# Altium schematic sheet LTC2666-16.SchDoc
size A; SheetNumber: 20; SheetTotal: 24
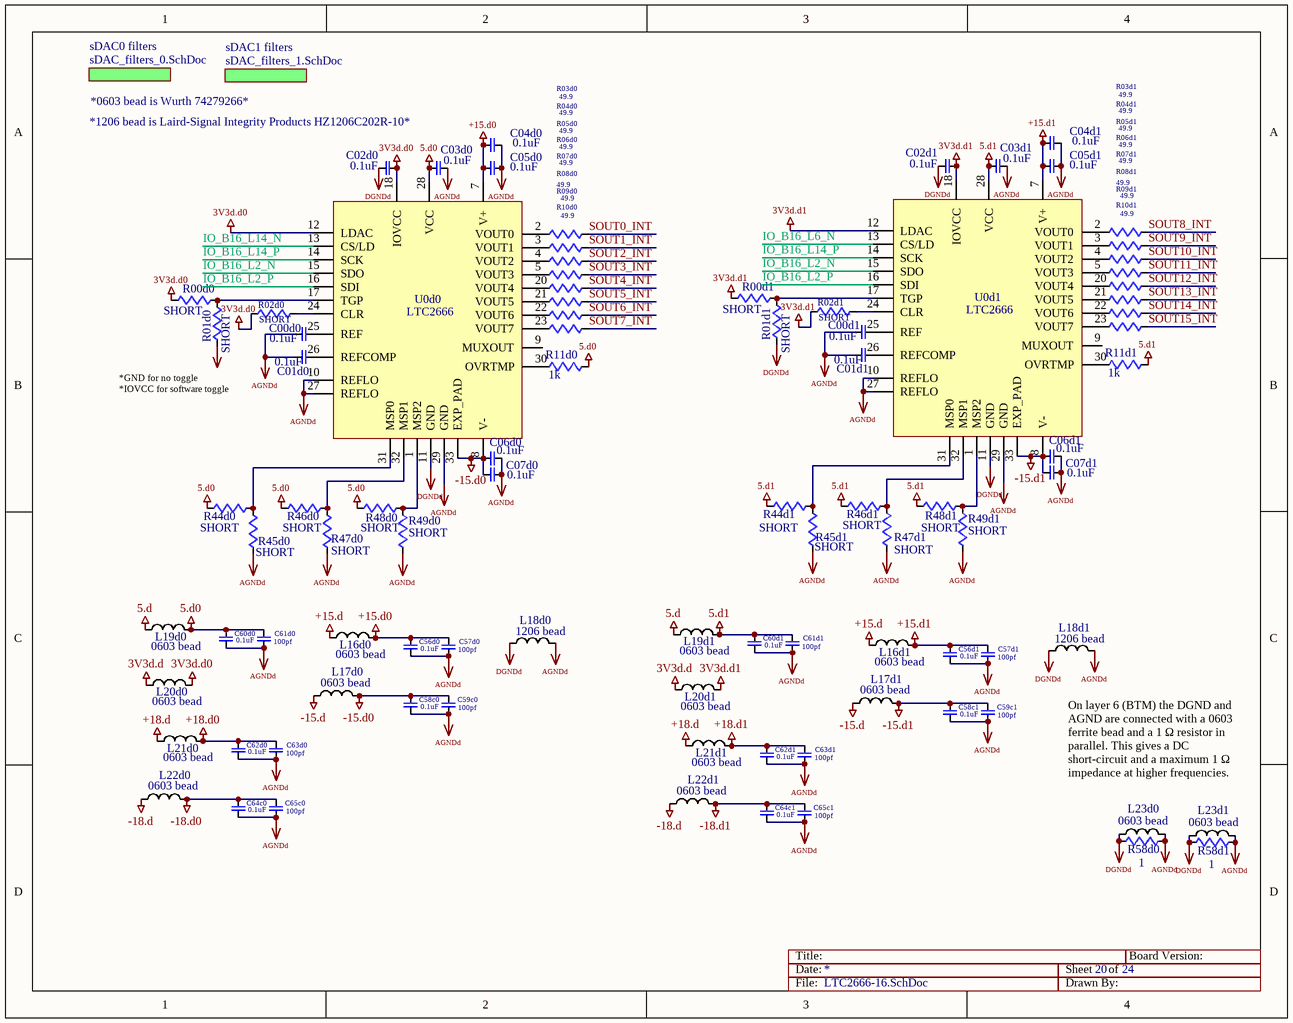
[diagram p0: LTC2666-16.SchDoc]

## Parts
C00d0  0.1uF  [0603]
C00d1  0.1uF  [0603]
C01d0  0.1uF  [0603]
C01d1  0.1uF  [0603]
C02d0  0.1uF  [0603]
C02d1  0.1uF  [0603]
C03d0  0.1uF  [0603]
C03d1  0.1uF  [0603]
C04d0  0.1uF  [0603]
C04d1  0.1uF  [0603]
C05d0  0.1uF  [0603]
C05d1  0.1uF  [0603]
C06d0  0.1uF  [0603]
C06d1  0.1uF  [0603]
C07d0  0.1uF  [0603]
C07d1  0.1uF  [0603]
C56d0  0.1uF  [0603]
C56d1  0.1uF  [0603]
C57d0  100pf  [0603]
C57d1  100pf  [0603]
C58c0  0.1uF  [0603]
C58c1  0.1uF  [0603]
C59c0  100pf  [0603]
C59c1  100pf  [0603]
C60d0  0.1uF  [0603]
C60d1  0.1uF  [0603]
C61d0  100pf  [0603]
C61d1  100pf  [0603]
C62d0  0.1uF  [0603]
C62d1  0.1uF  [0603]
C63d0  100pf  [0603]
C63d1  100pf  [0603]
C64c0  0.1uF  [0603]
C64c1  0.1uF  [0603]
C65c0  100pf  [0603]
C65c1  100pf  [0603]
L16d0  0603 bead  [0603]
L16d1  0603 bead  [0603]
L17d0  0603 bead  [0603]
L17d1  0603 bead  [0603]
L18d0  1206 bead  [1206]
L18d1  1206 bead  [1206]
L19d0  0603 bead  [0603]
L19d1  0603 bead  [0603]
L20d0  0603 bead  [0603]
L20d1  0603 bead  [0603]
L21d0  0603 bead  [0603]
L21d1  0603 bead  [0603]
L22d0  0603 bead  [0603]
L22d1  0603 bead  [0603]
L23d0  0603 bead  [0603]
L23d1  0603 bead  [0603]
R00d0  SHORT  [0603]
R00d1  SHORT  [0603]
R01d0  SHORT  [0603]
R01d1  SHORT  [0603]
R02d0  SHORT  [0603]
R02d1  SHORT  [0603]
R03d0  49.9  [0603]
R03d1  49.9  [0603]
R04d0  49.9  [0603]
R04d1  49.9  [0603]
R05d0  49.9  [0603]
R05d1  49.9  [0603]
R06d0  49.9  [0603]
R06d1  49.9  [0603]
R07d0  49.9  [0603]
R07d1  49.9  [0603]
R08d0  49.9  [0603]
R08d1  49.9  [0603]
R09d0  49.9  [0603]
R09d1  49.9  [0603]
R10d0  49.9  [0603]
R10d1  49.9  [0603]
R11d0  1k  [0603]
R11d1  1k  [0603]
R44d0  SHORT  [0603]
R44d1  SHORT  [0603]
R45d0  SHORT  [0603]
R45d1  SHORT  [0603]
R46d0  SHORT  [0603]
R46d1  SHORT  [0603]
R47d0  SHORT  [0603]
R47d1  SHORT  [0603]
R48d0  SHORT  [0603]
R48d1  SHORT  [0603]
R49d0  SHORT  [0603]
R49d1  SHORT  [0603]
R58d0  1  [0603]
R58d1  1  [0603]
U0d0  LTC2666  [32QFN]
U0d1  LTC2666  [32QFN]

## Sub-sheets
sDAC0 filters = sDAC_filters_0.SchDoc: no entries
sDAC1 filters = sDAC_filters_1.SchDoc: no entries

## Nets
3V3d.d: L20d0.1 L20d1.1
3V3d.d0: C02d0.1 L20d0.2 R00d0.2 R02d0.2 U0d0.12(LDAC) U0d0.18(IOVCC)
3V3d.d1: C02d1.1 L20d1.2 R00d1.2 R02d1.2 U0d1.12(LDAC) U0d1.18(IOVCC)
5.d: L19d0.1 L19d1.1
5.d0: C03d0.2 C60d0.1 C61d0.1 L19d0.2 R11d0.2 R44d0.2 R46d0.2 R48d0.2 U0d0.28(VCC)
5.d1: C03d1.2 C60d1.1 C61d1.1 L19d1.2 R11d1.2 R44d1.2 R46d1.2 R48d1.2 U0d1.28(VCC)
+15.d: L16d0.1 L16d1.1
+15.d0: C04d0.2 C05d0.2 C56d0.1 C57d0.1 L16d0.2 U0d0.7(V+)
+15.d1: C04d1.2 C05d1.2 C56d1.1 C57d1.1 L16d1.2 U0d1.7(V+)
+18.d: L21d0.1 L21d1.1
+18.d0: C62d0.1 C63d0.1 L21d0.2
+18.d1: C62d1.1 C63d1.1 L21d1.2
-15.d: L17d0.1 L17d1.1
-15.d0: C06d0.2 C07d0.2 C58c0.1 C59c0.1 L17d0.2 U0d0.8(V-) U0d0.33(EXP_PAD)
-15.d1: C06d1.2 C07d1.2 C58c1.1 C59c1.1 L17d1.2 U0d1.8(V-) U0d1.33(EXP_PAD)
-18.d: L22d0.1 L22d1.1
-18.d0: C64c0.1 C65c0.1 L22d0.2
-18.d1: C64c1.1 C65c1.1 L22d1.2
AGNDd: C00d0.2 C00d1.2 C01d0.2 C01d1.2 C03d0.1 C03d1.1 C04d0.1 C04d1.1 C05d0.1 C05d1.1 C06d0.1 C06d1.1 C07d0.1 C07d1.1 C56d0.2 C56d1.2 C57d0.2 C57d1.2 C58c0.2 C58c1.2 C59c0.2 C59c1.2 C60d0.2 C60d1.2 C61d0.2 C61d1.2 C62d0.2 C62d1.2 C63d0.2 C63d1.2 C64c0.2 C64c1.2 C65c0.2 C65c1.2 L18d0.2 L18d1.2 L23d0.2 L23d1.2 R45d0.2 R45d1.2 R47d0.2 R47d1.2 R49d0.2 R49d1.2 R58d0.1 R58d1.1 U0d0.10(REFLO) U0d0.27(REFLO) U0d0.29(GND) U0d1.10(REFLO) U0d1.27(REFLO) U0d1.29(GND)
DGNDd: C02d0.2 C02d1.2 L18d0.1 L18d1.1 L23d0.1 L23d1.1 R01d0.1 R01d1.1 R58d0.2 R58d1.2 U0d0.11(GND) U0d1.11(GND)
IO_B16_L2_N: U0d0.15(SDO) U0d1.15(SDO)
IO_B16_L2_P: U0d0.16(SDI) U0d1.16(SDI)
IO_B16_L6_N: U0d1.13(CS/LD)
IO_B16_L14_N: U0d0.13(CS/LD)
IO_B16_L14_P: U0d0.14(SCK) U0d1.14(SCK)
SOUT0_INT: R03d0.2
SOUT1_INT: R04d0.2
SOUT2_INT: R05d0.2
SOUT3_INT: R06d0.2
SOUT4_INT: R07d0.2
SOUT5_INT: R08d0.2
SOUT6_INT: R09d0.2
SOUT7_INT: R10d0.2
SOUT8_INT: R03d1.2
SOUT9_INT: R04d1.2
SOUT10_INT: R05d1.2
SOUT11_INT: R06d1.2
SOUT12_INT: R07d1.2
SOUT13_INT: R08d1.2
SOUT14_INT: R09d1.2
SOUT15_INT: R10d1.2
NetC00d0_1: C00d0.1 U0d0.25(REF)
NetC00d1_1: C00d1.1 U0d1.25(REF)
NetC01d0_1: C01d0.1 U0d0.26(REFCOMP)
NetC01d1_1: C01d1.1 U0d1.26(REFCOMP)
NetR00d0_1: R00d0.1 R01d0.2 U0d0.17(TGP)
NetR00d1_1: R00d1.1 R01d1.2 U0d1.17(TGP)
NetR02d0_1: R02d0.1 U0d0.24(CLR)
NetR02d1_1: R02d1.1 U0d1.24(CLR)
NetR03d0_1: R03d0.1 U0d0.2(VOUT0)
NetR03d1_1: R03d1.1 U0d1.2(VOUT0)
NetR04d0_1: R04d0.1 U0d0.3(VOUT1)
NetR04d1_1: R04d1.1 U0d1.3(VOUT1)
NetR05d0_1: R05d0.1 U0d0.4(VOUT2)
NetR05d1_1: R05d1.1 U0d1.4(VOUT2)
NetR06d0_1: R06d0.1 U0d0.5(VOUT3)
NetR06d1_1: R06d1.1 U0d1.5(VOUT3)
NetR07d0_1: R07d0.1 U0d0.20(VOUT4)
NetR07d1_1: R07d1.1 U0d1.20(VOUT4)
NetR08d0_1: R08d0.1 U0d0.21(VOUT5)
NetR08d1_1: R08d1.1 U0d1.21(VOUT5)
NetR09d0_1: R09d0.1 U0d0.22(VOUT6)
NetR09d1_1: R09d1.1 U0d1.22(VOUT6)
NetR10d0_1: R10d0.1 U0d0.23(VOUT7)
NetR10d1_1: R10d1.1 U0d1.23(VOUT7)
NetR11d0_1: R11d0.1 U0d0.30(OVRTMP)
NetR11d1_1: R11d1.1 U0d1.30(OVRTMP)
NetR44d0_1: R44d0.1 R45d0.1 U0d0.31(MSP0)
NetR44d1_1: R44d1.1 R45d1.1 U0d1.31(MSP0)
NetR46d0_1: R46d0.1 R47d0.1 U0d0.32(MSP1)
NetR46d1_1: R46d1.1 R47d1.1 U0d1.32(MSP1)
NetR48d0_1: R48d0.1 R49d0.1 U0d0.1(MSP2)
NetR48d1_1: R48d1.1 R49d1.1 U0d1.1(MSP2)

Not connected (* = marked no-connect by the designer): U0d0 9(MUXOUT); U0d1 9(MUXOUT)

## Notes on the sheet
- *1206 bead is Laird-Signal Integrity Products HZ1206C202R-10*
- *0603 bead is Wurth 74279266*
- (near R01d0) *GND for no toggle
  *IOVCC for software toggle
- On layer 6 (BTM) the DGND and AGND are connected with a 0603 ferrite bead and a 1 Ω resistor in parallel. This gives a DC short-circuit and a maximum 1 Ω impedance at higher frequencies.
- Title:
- Date:
- Sheet
- of
- Board Version:
- File:
- Drawn By:

## Library data of the parts
C00d0 C00d1 C01d0 C01d1 C02d0 C02d1 C03d0 C03d1 C04d0 C04d1 C05d0 C05d1 C06d0 C06d1 C07d0 C07d1 C56d0 C56d1 C57d0 C57d1 C58c0 C58c1 C59c0 C59c1 C60d0 C60d1 C61d0 C61d1 C62d0 C62d1 C63d0 C63d1 C64c0 C64c1 C65c0 C65c1 = CAP
L16d0 L16d1 L17d0 L17d1 L18d0 L18d1 L19d0 L19d1 L20d0 L20d1 L21d0 L21d1 L22d0 L22d1 L23d0 L23d1 = INDUCTOR
R00d0 R00d1 R01d0 R01d1 R02d0 R02d1 R03d0 R03d1 R04d0 R04d1 R05d0 R05d1 R06d0 R06d1 R07d0 R07d1 R08d0 R08d1 R09d0 R09d1 R10d0 R10d1 R11d0 R11d1 R44d0 R44d1 R45d0 R45d1 R46d0 R46d1 R47d0 R47d1 R48d0 R48d1 R49d0 R49d1 R58d0 R58d1 = RES